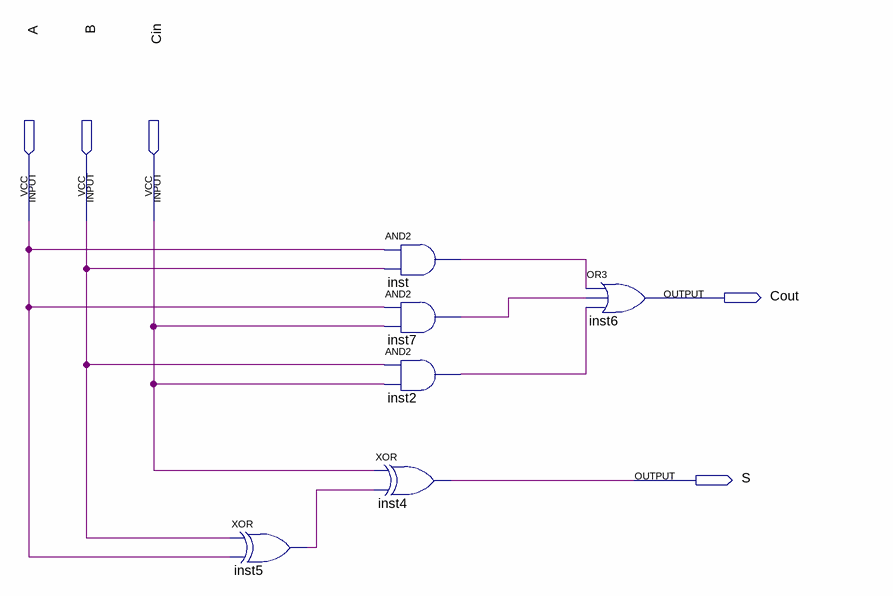
[diagram p0: schematic sheet]
// Quartus schematic FA1BIT.bdf as structural Verilog: 6 symbols, 5 pins
module FA1BIT (
  input  A,
  input  B,
  input  Cin,
  output Cout,
  output S
);

  wire inst2_out, inst5_out, inst7_out, inst_out;

  xor inst5 (inst5_out, B, A);
  xor inst4 (S, Cin, inst5_out);
  and inst (inst_out, A, B);
  and inst7 (inst7_out, A, Cin);
  and inst2 (inst2_out, B, Cin);
  or inst6 (Cout, inst_out, inst7_out, inst2_out);
endmodule
